# EAGLE board headstage-64 (EAGLE 8.3.2), part 1 of 2
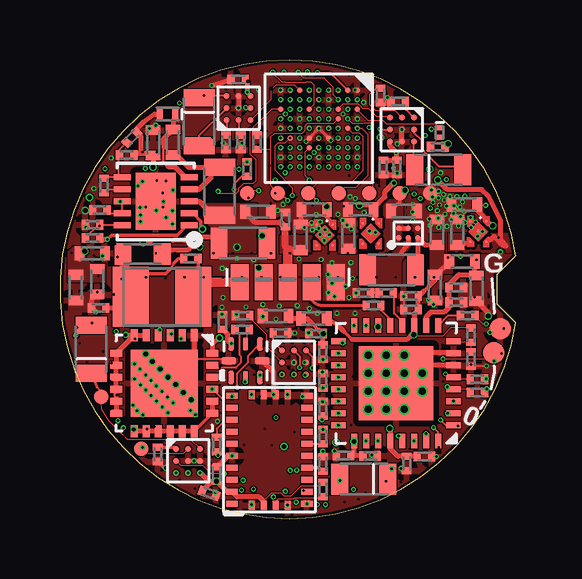
[diagram p5: board, top side]
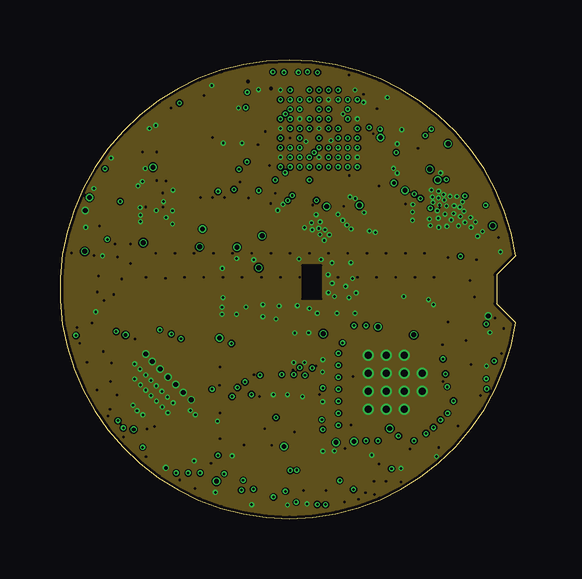
[diagram p6: board, inner layer GND1]
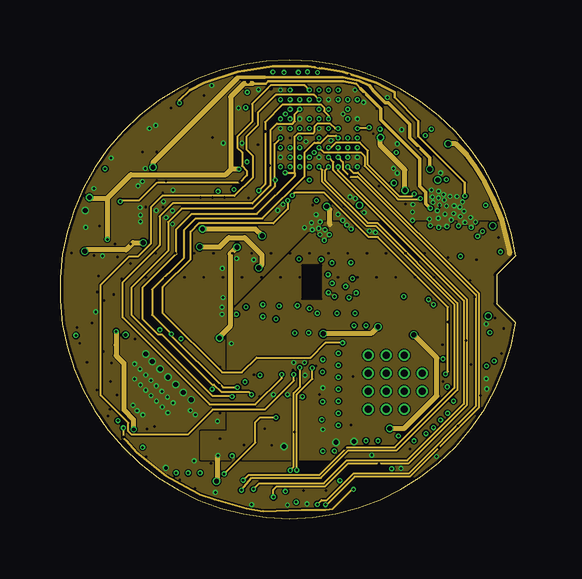
[diagram p7: board, inner layer Route2/PWR]
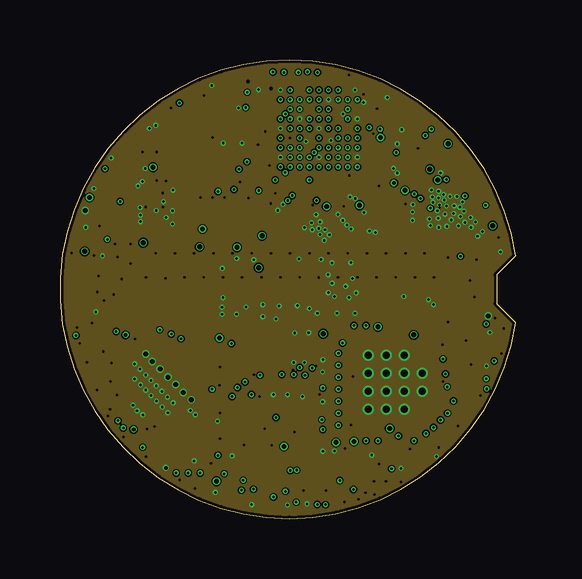
[diagram p8: board, inner layer GND2]
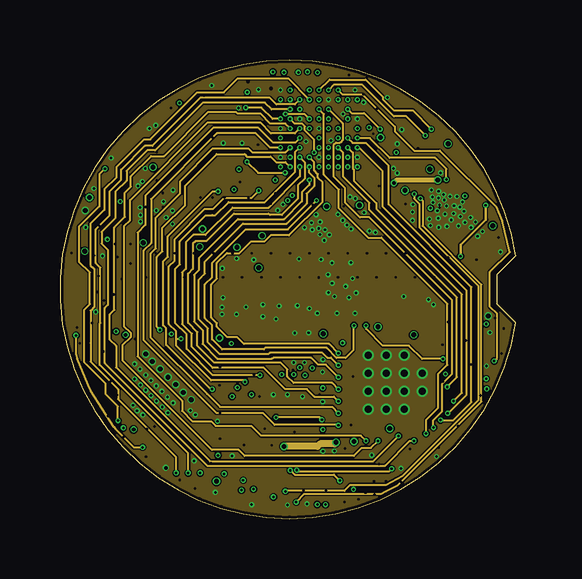
[diagram p9: board, inner layer Route3]
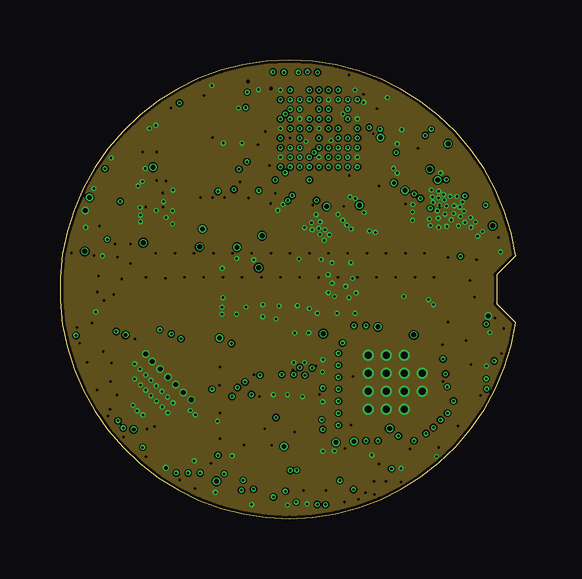
[diagram p10: board, inner layer GND3]
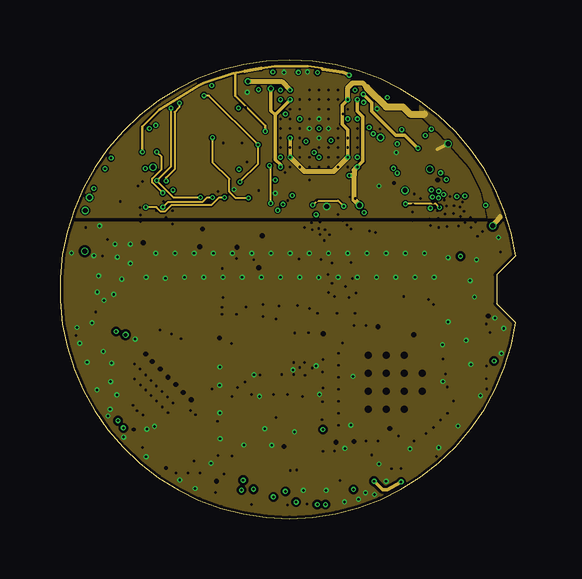
[diagram p11: board, inner layer AGND/PWR]
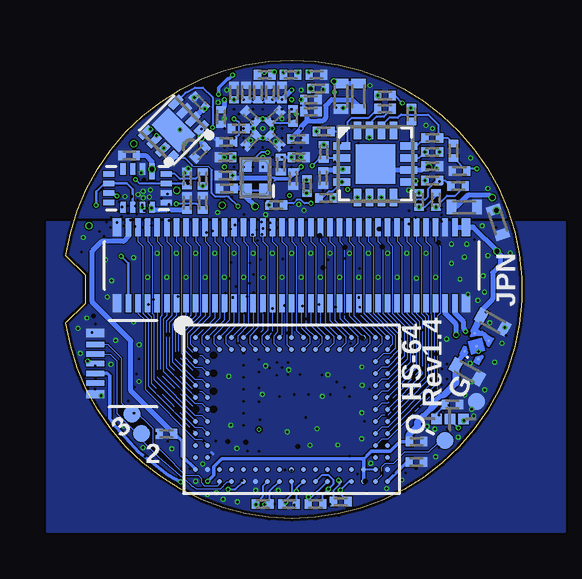
[diagram p12: board, bottom side, seen from below]

Size 18.99 x 19.11 mm. Coordinates in mm from the lower left corner, seen from the top.
Outline: 18.99,10.95 18.19,10.15 18.19,8.95 18.99,8.15 arc-343 18.99,10.95
Copper layers ((1*2*3*4*5*6)+(7*16)): Top 0.036mm / dielectric 4mil / GND1 0.036mm / dielectric 5mil / Route2/PWR 0.036mm / dielectric 0.10921875mm / GND2 0.036mm / dielectric 5mil / Route3 0.036mm / dielectric 4mil / GND3 0.035mm / dielectric 0.15mm / AGND/PWR 0.035mm / dielectric 0.2mm / Bottom 0.036mm
Design rules "headstage-256 *": minimum track width 2mil, minimum drill 0.1mm, track to track 2mil, track to pad 2mil, pad to pad 2mil, via to via 2mil, smd to smd 2mil, copper to edge 5mil, drill to drill 5mil, minimum pad ring 2mil, minimum via ring 2mil, stop-mask expansion 1mil, vias tented up to drill 1mm, thermal gap 10mil
Net classes: 1 thick: width 0.1 mm; 2 diff: width 0.076 mm, drill 0.1 mm, clearance 0.051 mm
tRestrict: area 10.1,9.1 to 10.9,10.7; 3 lines

## Footprints (pad centres in the part's own frame; a part is rotated, then mirrored left to right if it is on the bottom)
0201T = smd 0.3 x 0.4: 1 -0.3,0; 2 0.3,0
0402T = smd 0.4 x 0.6: 1 -0.533,0; 2 0.533,0
LED-0201T = smd 0.2 x 0.35: 1 -0.2,0; 2 0.2,0
CLP1006-2L = smd 0.24 x 0.49: A -0.325,0; C 0.325,0
0805PT = smd 0.7 x 1.3: A -1,0; C 1,0
HEADSTAGE-64-REV1.4-DAUGHTER-CARD = smd 0.75 x 1.5: 1 -2.55,-0.1; 2 -1.55,-0.1; 3 -0.55,-0.1; 4 0.45,-0.1; 5 1.45,-0.1
DF40-70HEAD-LESS-SILK = smd 0.23 x 0.75: 1 -6.8,-1.585; 2 -6.4,-1.585; 3 -6,-1.585; 4 -5.6,-1.585; 5 -5.2,-1.585; 6 -4.8,-1.585; 7 -4.4,-1.585; 8 -4,-1.585; 9 -3.6,-1.585; 10 -3.2,-1.585; 11 -2.8,-1.585; 12 -2.4,-1.585; 13 -2,-1.585; 14 -1.6,-1.585; 15 -1.2,-1.585; 16 -0.8,-1.585; 17 -0.4,-1.585; 18 0,-1.585; 19 0.4,-1.585; 20 0.8,-1.585; 21 1.2,-1.585; 22 1.6,-1.585; 23 2,-1.585; 24 2.4,-1.585; 25 2.8,-1.585; 26 3.2,-1.585; 27 3.6,-1.585; 28 4,-1.585; 29 4.4,-1.585; 30 4.8,-1.585; 31 5.2,-1.585; 32 5.6,-1.585; 33 6,-1.585; 34 6.4,-1.585; 35 6.8,-1.585; 36 6.8,1.585; 37 6.4,1.585; 38 6,1.585; 39 5.6,1.585; 40 5.2,1.585; 41 4.8,1.585; 42 4.4,1.585; 43 4,1.585; 44 3.6,1.585; 45 3.2,1.585; 46 2.8,1.585; 47 2.4,1.585; 48 2,1.585; 49 1.6,1.585; 50 1.2,1.585; 51 0.8,1.585; 52 0.4,1.585; 53 0,1.585; 54 -0.4,1.585; 55 -0.8,1.585; 56 -1.2,1.585; 57 -1.6,1.585; 58 -2,1.585; 59 -2.4,1.585; 60 -2.8,1.585; 61 -3.2,1.585; 62 -3.6,1.585; 63 -4,1.585; 64 -4.4,1.585; 65 -4.8,1.585; 66 -5.2,1.585; 67 -5.6,1.585; 68 -6,1.585; 69 -6.4,1.585; 70 -6.8,1.585 | smd 0.35 x 0.75: M1 -7.275,-1.585; M2 7.275,-1.585; M3 7.275,1.585; M4 -7.275,1.585
DF40-10HEAD_HALF = smd 0.23 x 0.75: 1 -0.8,-1.585; 2 -0.4,-1.585; 3 0,-1.585; 4 0.4,-1.585; 5 0.8,-1.585 | smd 0.35 x 0.75: M1 -1.275,-1.585; M2 1.275,-1.585
0603T = smd 0.7 x 0.9: 1 -0.82,0; 2 0.82,0
1210T = smd 1.5 x 2.5: 1 -1.3,0; 2 1.3,0
0805T = smd 0.7 x 1.3: 1 -1,0; 2 1,0
SJ_2_0201_T = smd 0.432 x 0.432: 1 -0.559,0; 2 0.559,0; COM 0,0
TP09R = smd 0.9 x 0.9: TP 0,0
TP07R = smd 0.7 x 0.7: TP 0,0
TP06R = smd 0.6 x 0.6: TP 0,0
CP_16_27-L = smd 0.711 x 0.305: 1 -1.397,0.75; 2 -1.397,0.25; 3 -1.397,-0.25; 4 -1.397,-0.75; 9 1.397,-0.75; 10 1.397,-0.25; 11 1.397,0.25; 12 1.397,0.75 | smd 0.305 x 0.711: 5 -0.75,-1.397; 6 -0.25,-1.397; 7 0.25,-1.397; 8 0.75,-1.397; 13 0.75,1.397; 14 0.25,1.397; 15 -0.25,1.397; 16 -0.75,1.397 | smd 1.651 x 1.651: PAD 0,0
CP_8_10-L = smd 0.635 x 0.305: 1 -0.889,0.75; 2 -0.889,0.25; 3 -0.889,-0.25; 4 -0.889,-0.75; 5 0.889,-0.75; 6 0.889,-0.25; 7 0.889,0.25; 8 0.889,0.75 | smd 0.991 x 1.6: PAD 0,0
MQFN16-1.8X2.6 = smd 0.663 x 0.225: 1 -0.7,0.6 | smd 0.463 x 0.225: 2 -0.8,0.2; 3 -0.8,-0.2; 4 -0.8,-0.6; 9 0.8,-0.6; 10 0.8,-0.2; 11 0.8,0.2; 12 0.8,0.6 | smd 0.225 x 0.463: 5 -0.6,-1.2; 6 -0.2,-1.2; 7 0.2,-1.2; 8 0.6,-1.2; 13 0.6,1.2; 14 0.2,1.2; 15 -0.2,1.2; 16 -0.6,1.2
WQFN32-5X5 = smd 0.25 x 0.6: 1 1.75,2.4; 2 1.25,2.4; 3 0.75,2.4; 4 0.25,2.4; 5 -0.25,2.4; 6 -0.75,2.4; 7 -1.25,2.4; 8 -1.75,2.4; 17 -1.75,-2.4; 18 -1.25,-2.4; 19 -0.75,-2.4; 20 -0.25,-2.4; 21 0.25,-2.4; 22 0.75,-2.4; 23 1.25,-2.4; 24 1.75,-2.4 | smd 0.6 x 0.25: 9 -2.4,1.75; 10 -2.4,1.25; 11 -2.4,0.75; 12 -2.4,0.25; 13 -2.4,-0.25; 14 -2.4,-0.75; 15 -2.4,-1.25; 16 -2.4,-1.75; 25 2.4,-1.75; 26 2.4,-1.25; 27 2.4,-0.75; 28 2.4,-0.25; 29 2.4,0.25; 30 2.4,0.75; 31 2.4,1.25; 32 2.4,1.75 | smd 3.1 x 3.1: PAD 0,0
QFN24-4X4 = smd 0.5 x 0.3: 1 -2,1.25; 2 -2,0.75; 3 -2,0.25; 4 -2,-0.25; 5 -2,-0.75; 6 -2,-1.25; 13 2,-1.25; 14 2,-0.75; 15 2,-0.25; 16 2,0.25; 17 2,0.75; 18 2,1.25 | smd 0.3 x 0.5: 7 -1.25,-2; 8 -0.75,-2; 9 -0.25,-2; 10 0.25,-2; 11 0.75,-2; 12 1.25,-2; 19 1.25,2; 20 0.75,2; 21 0.25,2; 22 -0.25,2; 23 -0.75,2; 24 -1.25,2 | smd 2.8 x 2.8: PAD 0,0
UQFN = smd 0.55 x 0.25: 1 -0.7,0.6; 3 -0.7,-0.6; 5 0.7,-0.6; 7 0.7,0.6 | smd 0.55 x 0.2: 2 -0.7,0; 6 0.7,0 | smd 0.3 x 0.6: 4 0,-0.7; 8 0,0.7
BGA104_0.5MM = smd 0.2 x 0.2: A1 -4,3; A2 -3.5,3; A3 -3,3; A4 -2.5,3; A5 -2,3; A6 -1.5,3; A7 -1,3; A8 -0.5,3; A9 0,3; A10 0.5,3; A11 1,3; A12 1.5,3; A13 2,3; A14 2.5,3; A15 3,3; A16 3.5,3; A17 4,3; B1 -4,2.5; B2 -3.5,2.5; B3 -3,2.5; B4 -2.5,2.5; B5 -2,2.5; B6 -1.5,2.5; B7 -1,2.5; B8 -0.5,2.5; B9 0,2.5; B10 0.5,2.5; B11 1,2.5; B12 1.5,2.5; B13 2,2.5; B14 2.5,2.5; B15 3,2.5; B16 3.5,2.5; B17 4,2.5; C1 -4,2; C2 -3.5,2; C16 3.5,2; C17 4,2; D1 -4,1.5; D2 -3.5,1.5; D16 3.5,1.5; D17 4,1.5; E1 -4,1; E2 -3.5,1; E16 3.5,1; E17 4,1; F1 -4,0.5; F2 -3.5,0.5; F16 3.5,0.5; F17 4,0.5; G1 -4,0; G2 -3.5,0; G16 3.5,0; G17 4,0; H1 -4,-0.5; H2 -3.5,-0.5; H16 3.5,-0.5; H17 4,-0.5; J1 -4,-1; J2 -3.5,-1; J16 3.5,-1; J17 4,-1; K1 -4,-1.5; K2 -3.5,-1.5; K16 3.5,-1.5; K17 4,-1.5; L1 -4,-2; L2 -3.5,-2; L16 3.5,-2; L17 4,-2; M1 -4,-2.5; M2 -3.5,-2.5; M3 -3,-2.5; M4 -2.5,-2.5; M5 -2,-2.5; M6 -1.5,-2.5; M7 -1,-2.5; M8 -0.5,-2.5; M9 0,-2.5; M10 0.5,-2.5; M11 1,-2.5; M12 1.5,-2.5; M13 2,-2.5; M14 2.5,-2.5; M15 3,-2.5; M16 3.5,-2.5; M17 4,-2.5; N1 -4,-3; N2 -3.5,-3; N3 -3,-3; N4 -2.5,-3; N5 -2,-3; N6 -1.5,-3; N7 -1,-3; N8 -0.5,-3; N9 0,-3; N10 0.5,-3; N11 1,-3; N12 1.5,-3; N13 2,-3; N14 2.5,-3; N15 3,-3; N16 3.5,-3; N17 4,-3
VBGA81-4X4 = smd 0.23 x 0.23: A1 1.6,1.6; A2 1.2,1.6; A3 0.8,1.6; A4 0.4,1.6; A5 0,1.6; A6 -0.4,1.6; A7 -0.8,1.6; A8 -1.2,1.6; A9 -1.6,1.6; B1 1.6,1.2; B2 1.2,1.2; B3 0.8,1.2; B4 0.4,1.2; B5 0,1.2; B6 -0.4,1.2; B7 -0.8,1.2; B8 -1.2,1.2; B9 -1.6,1.2; C1 1.6,0.8; C2 1.2,0.8; C3 0.8,0.8; C4 0.4,0.8; C5 0,0.8; C6 -0.4,0.8; C7 -0.8,0.8; C8 -1.2,0.8; C9 -1.6,0.8; D1 1.6,0.4; D2 1.2,0.4; D3 0.8,0.4; D4 0.4,0.4; D5 0,0.4; D6 -0.4,0.4; D7 -0.8,0.4; D8 -1.2,0.4; D9 -1.6,0.4; E1 1.6,0; E2 1.2,0; E3 0.8,0; E4 0.4,0; E5 0,0; E6 -0.4,0; E7 -0.8,0; E8 -1.2,0; E9 -1.6,0; F1 1.6,-0.4; F2 1.2,-0.4; F3 0.8,-0.4; F4 0.4,-0.4; F5 0,-0.4; F6 -0.4,-0.4; F7 -0.8,-0.4; F8 -1.2,-0.4; F9 -1.6,-0.4; G1 1.6,-0.8; G2 1.2,-0.8; G3 0.8,-0.8; G4 0.4,-0.8; G5 0,-0.8; G6 -0.4,-0.8; G7 -0.8,-0.8; G8 -1.2,-0.8; G9 -1.6,-0.8; H1 1.6,-1.2; H2 1.2,-1.2; H3 0.8,-1.2; H4 0.4,-1.2; H5 0,-1.2; H6 -0.4,-1.2; H7 -0.8,-1.2; H8 -1.2,-1.2; H9 -1.6,-1.2; J1 1.6,-1.6; J2 1.2,-1.6; J3 0.8,-1.6; J4 0.4,-1.6; J5 0,-1.6; J6 -0.4,-1.6; J7 -0.8,-1.6; J8 -1.2,-1.6; J9 -1.6,-1.6
DFN103X3 = smd 0.7 x 0.25: 1 -1.4,1; 2 -1.4,0.5; 3 -1.4,0; 4 -1.4,-0.5; 5 -1.4,-1; 6 1.4,-1; 7 1.4,-0.5; 8 1.4,0; 9 1.4,0.5; 10 1.4,1 | smd 1.65 x 2.38: PAD 0,0
LGA-28-3.8X5.2 = smd 0.25 x 0.475: 1 -2.25,1.56; 6 -2.25,-1.56; 7 -1.75,-1.56; 8 -1.25,-1.56; 9 -0.75,-1.56; 10 -0.25,-1.56; 11 0.25,-1.56; 12 0.75,-1.56; 13 1.25,-1.56; 14 1.75,-1.56; 15 2.25,-1.56; 20 2.25,1.56; 21 1.75,1.56; 22 1.25,1.56; 23 0.75,1.56; 24 0.25,1.56; 25 -0.25,1.56; 26 -0.75,1.56; 27 -1.25,1.56; 28 -1.75,1.56 | smd 0.375 x 0.25: 2 -2.3,0.75; 3 -2.3,0.25; 4 -2.3,-0.25; 5 -2.3,-0.75; 16 2.3,-0.75; 17 2.3,-0.25; 18 2.3,0.25; 19 2.3,0.75
X2SON = smd 0.1 x 0.1: 1 -0.43,0.33; 2 -0.43,-0.33; 3 0.43,-0.33; 4 0.43,0.33 | smd 0.1 x 0.1 rotated 45: PAD 0,0
ASCO = smd 0.6 x 0.5: 1 -0.55,-0.4; 2 0.55,-0.4; 3 0.55,0.4; 4 -0.55,0.4
WLCSP3X3 = smd 0.25 x 0.25: A1 -0.5,0.5; A2 0,0.5; A3 0.5,0.5; B1 -0.5,0; B2 0,0; B3 0.5,0; C1 -0.5,-0.5; C2 0,-0.5; C3 0.5,-0.5
XBGA6_1.2X0.8 = smd 0.23 x 0.23: A1 0.2,-0.4; A2 -0.2,-0.4; B1 0.2,0; B2 -0.2,0; C1 0.2,0.4; C2 -0.2,0.4

## Placement (x,y rotation side)
C1  0.1uF  [0201T]  8.27,14.19 270 bottom
C2  0.1uF  [0201T]  1.61,8.77 180 top
C3  10uF  [0402T]  1.55,9.86 270 top
C4  10uF  [0402T]  1.34,11.05 0 top
C5  10uF  [0402T]  0.66,9.62 270 top
C6  0.1uF  [0201T]  9.39,12.45 90 top
C7  0.1uF  [0201T]  13.39,15.25 225 bottom
C8  0.1uF  [0201T]  13.43,17.35 135 bottom
C9  0.1uF  [0201T]  3.73,14.68 0 bottom
C10  0.1uF  [0201T]  13.94,13.15 90 bottom
C11  0.1uF  [0201T]  16.36,15.13 180 bottom
C12  10nF  [0201T]  16.51,9.01 0 top
C13  0.1uF  [0201T]  16.51,9.62 0 top
C14  4.7uF  [0402T]  17.36,9.59 270 top
C15  0.1uF  [0201T]  15.19,2.58 0 top
C16  10nF  [0201T]  14.44,2.29 270 top
C17  10nF  [0201T]  14.62,8.71 180 top
C18  0.1uF  [0201T]  14.62,9.27 180 top
C19  4.7uF  [0402T]  15.62,9.62 270 top
C20  0.1uF  [0201T]  12.92,2.61 0 top
C21  10nF  [0201T]  11.81,2.63 180 top
C22  10nF  [0201T]  10.67,7.7 180 top
C23  0.1uF  [0201T]  10.95,6.93 270 top
C24  15uF  [0402T]  8.98,8.43 180 top
C25  0.1uF  [0201T]  13.06,8.87 0 top
C26  47nF  [0201T]  13.59,9.4 0 top
C27  0.1uF  [0201T]  6.77,8.19 90 top
C28  10nF  [0201T]  4.39,2.35 0 bottom
C29  0.1uF  [0201T]  4.38,3.2 180 bottom
C30  1uF  [0402T]  8.25,12.78 0 top
C31  0.22uF  [0402T]  2.39,12.97 0 bottom
C32  10pF  [0201T]  2.99,15.88 45 top
C33  1uF  [0402T]  4.7,15.67 90 top
C34  0.22uF  [0402T]  3.88,15.65 90 top
C35  0.1uF  [0201T]  6.52,1.85 90 top
C36  0.1uF  [0201T]  10.95,2.27 270 top
C37  10uF  [0402T]  1.21,8.18 330.9 bottom
C38  10uF  [0402T]  2.28,6.12 330.9 bottom
C39  10nF  [0201T]  12.29,13.75 180 bottom
C40  0.1uF  [0201T]  10.95,5.74 90 top
C41  1uF  [0201T]  9.19,7.73 0 top
C42  10uF  [0402T]  10.03,11.71 90 top
C43  10uF  [0402T]  10.59,12.88 180 top
C44  1uF  [0201T]  13.47,14.63 270 top
C45  0.1uF  [0201T]  14.03,14.63 270 top
C46  10uF  [0402T]  12.01,11.77 90 top
C47  10uF  [0402T]  12.53,12.88 180 top
C48  1uF  [0201T]  14.09,17.37 180 top
C49  2.2nF  [0201T]  9.29,15.05 0 bottom
C50  4.7nF  [0201T]  12.34,15.05 180 bottom
C51  10nF  [0201T]  11.99,17.75 90 bottom
C52  22nF  [0201T]  8.79,17.45 0 bottom
C53  47nF  [0201T]  8.79,16.95 0 bottom
C54  0.1uF  [0201T]  10.04,14.75 270 bottom
C55  1uF  [0201T]  9.33,15.81 0 bottom
C56  4.7nF  [0201T]  9.99,17.75 90 bottom
C57  10nF  [0201T]  10.49,17.75 90 bottom
C58  22nF  [0201T]  10.99,17.75 90 bottom
C59  0.47uF  [0201T]  11.49,17.75 90 bottom
C60  10uF  [0402T]  7.53,17.59 270 bottom
C61  4.7nF  [0201T]  10.29,16.75 45 bottom
C62  10nF  [0201T]  10.29,15.75 315 bottom
C63  22nF  [0201T]  11.27,15.75 225 bottom
C64  47nF  [0201T]  11.29,16.75 135 bottom
C65  0.47uF  [0201T]  11.79,16.25 180 bottom
C66  0.1uF  [0201T]  7.42,18.29 180 top
C67  10uF  [0402T]  14.33,12.81 0 top
C68  4.7uF  [0402T]  15.71,11.93 90 top
C69  1uF  [0201T]  6.92,15.67 270 top
C70  4.7nF  [0201T]  9.52,14.15 270 bottom
C71  10nF  [0201T]  12.34,14.29 180 bottom
C72  22nF  [0201T]  8.49,17.91 0 bottom
C73  0.47uF  [0201T]  12.53,16.73 270 bottom
C74  1uF  [0402T]  16.55,11.93 90 top
C75  15uF  [0402T]  16.85,13.08 180 top
C76  0.1uF  [0201T]  6.21,1.05 340 top
C77  1uF  [0201T]  4.07,2.67 270 top
D1  XZVGR155W  [LED-0201T]  15.81,16.08 270 top
D2  VSKY05401006  [CLP1006-2L]  4.48,16.85 0 top
D3  VEMD1160X01  [0805PT]  12.66,1.64 0 top
D4  VEMD1160X01  [0805PT]  15.78,14.53 180 top
D5  VEMD1160X01  [0805PT]  5.8,16.53 90 top
D6  VEMD1160X01  [0805PT]  1.3,7.05 270 top
J1  [HEADSTAGE-64-REV1.4-DAUGHTER-CARD]  10.04,9.95 0 top
J2  DF40C-70DP-0.4V(51)  [DF40-70HEAD-LESS-SILK]  9.59,10.55 0 bottom
J3  DF40C-10DP-0.4V(51)  [DF40-10HEAD_HALF]  16.19,6.45 270 bottom
L1  BLM18KG601SN1D  [0603T]  3.44,11.02 0 top
L2  CBC3225T101MR  [1210T]  4.25,9.23 180 top
L3  BLM15PX601SN1D  [0402T]  16.75,10.71 0 top
L4  BLM15PX601SN1D  [0402T]  10.58,8.33 180 top
L5  BLM15PX601SN1D  [0402T]  0.99,12.35 287.8 bottom
L6  MLZ2012M100WT000  [0805T]  7.62,11.47 180 top
L7  MLZ2012M100WT000  [0805T]  6.65,13.63 270 top
L8  BLM15PX601SN1D  [0402T]  6.81,17.59 90 bottom
L9  LQM21PN1R0NGRD  [0805T]  13.81,10.36 180 top
R1  9k, 0.1%  [0201T]  8.25,15.27 90 bottom
R2  1k, 0.1%  [0201T]  8.15,13.35 180 bottom
R3  10k, 0.1%  [0201T]  10.23,13.06 0 bottom
R4  10k, 0.1%  [0201T]  4.6,16.84 90 bottom
R5  10k, 0.1%  [0201T]  3.73,15.86 180 bottom
R6  1k  [0201T]  5.45,10.83 180 top
R7  10k, 0.1%  [0201T]  8.25,16.13 0 bottom
R8  10k, 0.1%  [0201T]  3.73,14.09 180 bottom
R9  100  [0201T]  5.7,17.63 180 bottom
R10  2.86k, 1%  [0201T]  2.65,13.85 180 bottom
R11  10k, 0.1%  [0201T]  2.84,15.32 90 bottom
R12  10k, 0.1%  [0201T]  3.57,13.27 270 bottom
R13  10k, 0.1%  [0201T]  5.7,17.07 0 bottom
R14  10k, 0.1%  [0201T]  4.28,13.27 270 bottom
R15  10k, 0.1%  [0201T]  3.73,15.27 180 bottom
R16  10k, 0.1%  [0201T]  2.59,14.48 0 bottom
R17  1k  [0201T]  13.29,13.15 270 bottom
R18  10k  [0201T]  13.29,14.15 90 bottom
R19  10k  [0201T]  13.94,14.16 90 bottom
R20  49.9  [0201T]  12.64,9.4 0 top
R21  10k  [0201T]  17.13,7.64 270 top
R22  100k  [0201T]  17.13,6.64 270 top
R23  10k  [0201T]  16.99,8.45 180 top
R24  10k  [0201T]  8.21,15.68 90 top
R25  590  [0201T]  7.59,7.88 0 top
R26  100  [0201T]  10.79,0.6 0 bottom
R27  2k  [0201T]  15.74,15.49 180 top
R28  4.7k  [0201T]  7.79,14.56 270 top
R29  0  [0201T]  14.8,3.53 0 bottom
R30  100  [0201T]  9.69,0.6 0 bottom
R31  100  [0201T]  8.59,0.6 180 bottom
R32  10k  [0201T]  12.31,15.69 0 bottom
R33  1M  [0201T]  2.89,4.75 0 bottom
R34  4.7k  [0201T]  17.39,5.25 180 top
R35  1M  [0201T]  1.36,11.69 0 top
R36  90.9k  [0201T]  1.36,12.24 0 top
R37  100  [0201T]  7.54,0.7 0 bottom
R38  83.3k  [0201T]  1.83,13.87 270 top
R39  10k  [0201T]  1.66,12.85 180 top
R40  10k  [0201T]  10.96,1.21 270 top
R41  1M  [0201T]  2.78,15.14 180 top
R42  4.7k  [0201T]  8.94,13.85 270 bottom
R43  4.7k  [0201T]  17.39,5.8 180 top
R44  10k  [0201T]  10.95,3.41 90 top
R45  10k  [0201T]  6.53,3.08 90 top
R46  10k  [0201T]  9.53,16.77 90 bottom
R47  10k  [0201T]  9.63,18.49 180 bottom
R48  10k  [0201T]  10.71,18.49 180 bottom
R49  15k  [0201T]  7.61,8.45 0 top
R50  10k  [0201T]  8.55,18.49 0 bottom
R51  15k  [0201T]  13.35,17.63 90 top
R52  15k  [0201T]  7.53,15.67 90 top
R53  15k  [0201T]  10.95,4.57 270 top
SJ1  [SJ_2_0201_T]  2.99,4.15 180 bottom
TP1  [TP09R]  18.34,7.9 0 top
TP2  [TP09R]  18.07,6.91 0 top
TP3  VCC  [TP07R]  1.89,4.88 0 bottom
TP4  VCC  [TP07R]  3.19,3.25 0 bottom
TP5  VCC  [TP07R]  16.24,4.36 0 bottom
TP6  VCC  [TP07R]  15.85,3.54 0 bottom
TP7  [TP06R]  14.16,13.56 0 top
TP8  [TP06R]  9.08,13.56 270 top
TP9  [TP06R]  7.81,13.56 270 top
TP10  [TP06R]  11.62,13.56 270 top
TP11  [TP06R]  10.35,13.56 270 top
TP12  gnd  [TP06R]  12.89,13.56 270 top
TP13  VCC  [TP06R]  15.43,13.56 270 top
TP14  [TP06R]  1.71,5.07 0 top
TP15  [TP06R]  3.39,2.91 0 top
U1  ADA4062-4ACPZ-R7  [CP_16_27-L]  6.1,14.77 0 bottom
U2  AD5681RBCPZ-1RL7  [CP_8_10-L]  14.51,16.18 225 bottom
U3  DG509B  [MQFN16-1.8X2.6]  16.01,13.76 270 bottom
U4  DS90UB933A_WQFN  [WQFN32-5X5]  14,5.64 270 top
U5  CAT4016_QFN  [QFN24-4X4]  4.34,5.64 270 top
U6  TPL0501_UQFN  [UQFN]  7.73,6.57 90 top
U7  RHD2064_BGA  [BGA104_0.5MM]  9.59,4.55 0 bottom
U8  10M08DC  [VBGA81-4X4]  10.79,16.25 0 top
U9  LT3463  [DFN103X3]  3.99,13.21 180 top
U10  BNO055  [LGA-28-3.8X5.2]  8.73,2.86 90 top
U11  TLV70733  [X2SON]  1.88,7.18 60.9 bottom
U12  ASCO-50.000MHZ-EK-T3  [ASCO]  11.09,14.2 90 bottom
U13  TS4231  [WLCSP3X3]  9.74,6.5 0 top
U14  TLV70733  [X2SON]  11.03,11.81 270 top
U15  TS4231  [WLCSP3X3]  14.24,16.2 270 top
U16  TLV70725  [X2SON]  12.95,11.87 270 top
U17  TS4231  [WLCSP3X3]  7.44,17.1 90 top
U18  TPS62621  [XBGA6_1.2X0.8]  14.51,11.89 270 top
U19  TLV70712  [X2SON]  17.43,11.95 270 top
U20  TS4231  [WLCSP3X3]  5.34,2.4 0 top